# Altium schematic sheet LIDO-HW.003.BlockDiagram.SchDoc
size A3; CompanyName: EST-Floattech; DrawnBy: RR; Organization: EST-Floattech; Address2: Zandsteen 1; Address3: 2132 MZ; Address4: Hoofddorp; DocumentNumber: 21xxx; Revision: 1.0; SheetNumber: 3; SheetTotal: 17
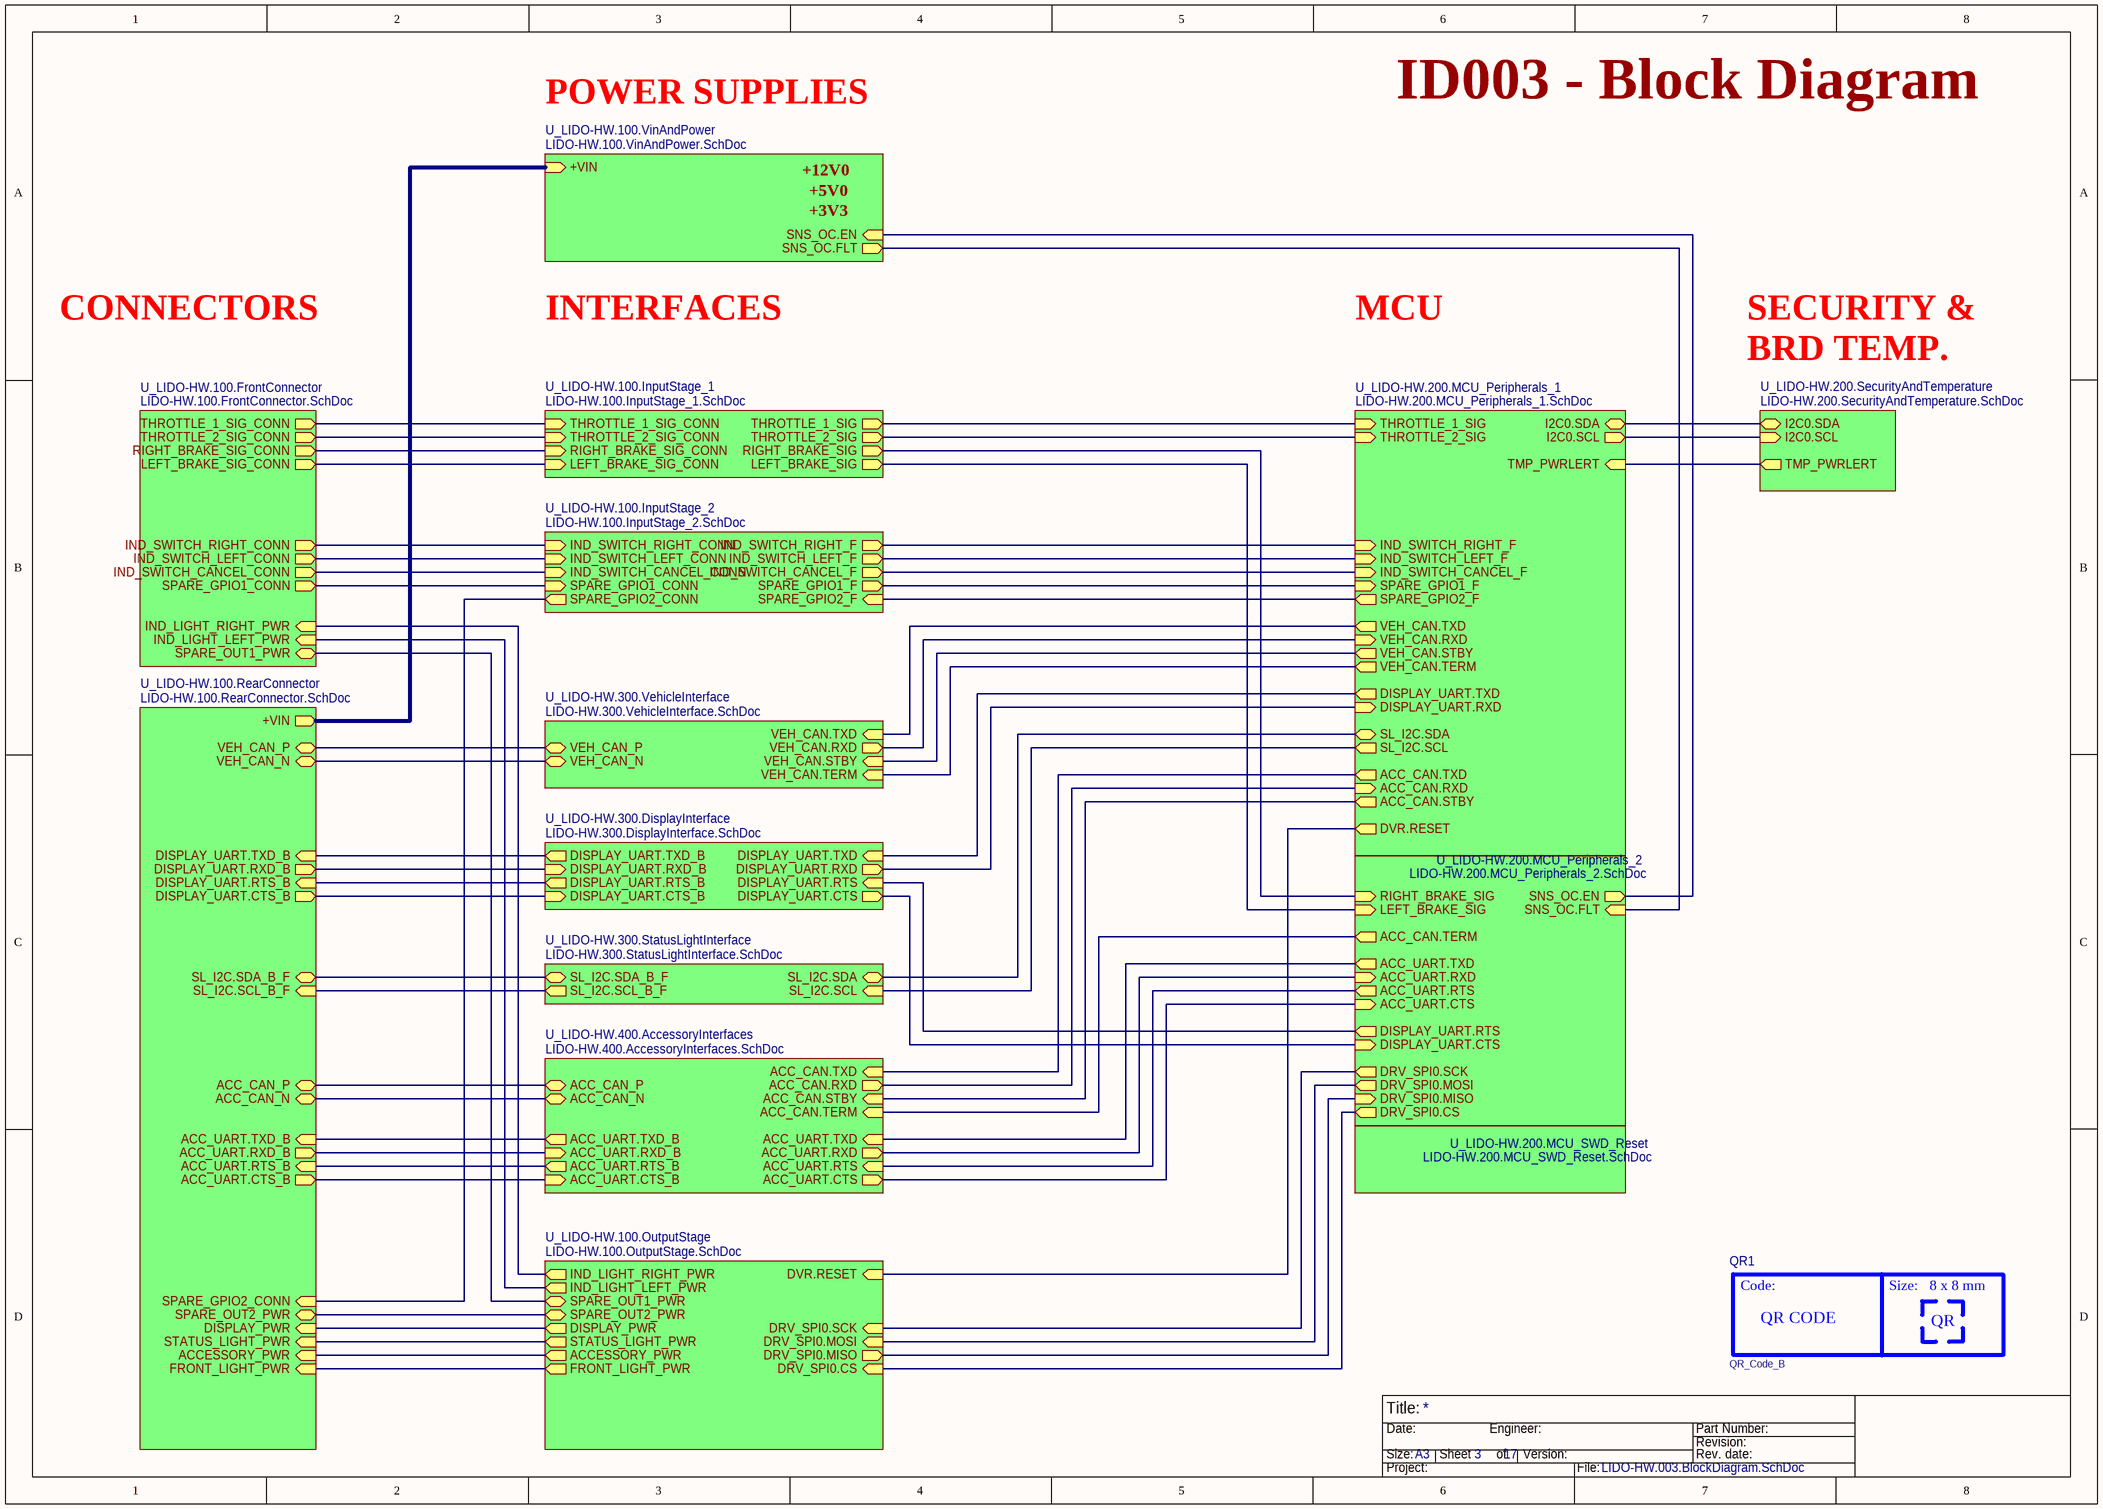
[diagram p0: LIDO-HW.003.BlockDiagram.SchDoc]

## Parts
QR1  QR_Code_B  [QR_CODE_8X8_A]  (no BOM)

## Sub-sheets
U_LIDO-HW.100.FrontConnector = LIDO-HW.100.FrontConnector.SchDoc: IND_LIGHT_LEFT_PWR (in), IND_LIGHT_RIGHT_PWR (in), THROTTLE_1_SIG_CONN (out), THROTTLE_2_SIG_CONN (out), RIGHT_BRAKE_SIG_CONN (out), LEFT_BRAKE_SIG_CONN (out), SPARE_OUT1_PWR (bidir), IND_SWITCH_CANCEL_CONN (out), SPARE_GPIO1_CONN (out), IND_SWITCH_LEFT_CONN (out), IND_SWITCH_RIGHT_CONN (out)
U_LIDO-HW.100.InputStage_1 = LIDO-HW.100.InputStage_1.SchDoc: THROTTLE_1_SIG (out), THROTTLE_1_SIG_CONN (in), THROTTLE_2_SIG (out), THROTTLE_2_SIG_CONN (in), RIGHT_BRAKE_SIG (out), RIGHT_BRAKE_SIG_CONN (in), LEFT_BRAKE_SIG (out), LEFT_BRAKE_SIG_CONN (in)
U_LIDO-HW.100.InputStage_2 = LIDO-HW.100.InputStage_2.SchDoc: IND_SWITCH_LEFT_F (out), IND_SWITCH_LEFT_CONN (in), IND_SWITCH_RIGHT_CONN (in), IND_SWITCH_RIGHT_F (out), SPARE_GPIO1_CONN (in), IND_SWITCH_CANCEL_CONN (in), IND_SWITCH_CANCEL_F (out), SPARE_GPIO2_CONN (out), SPARE_GPIO1_F (out), SPARE_GPIO2_F (in)
U_LIDO-HW.100.OutputStage = LIDO-HW.100.OutputStage.SchDoc: FRONT_LIGHT_PWR (out), IND_LIGHT_LEFT_PWR (out), IND_LIGHT_RIGHT_PWR (out), ACCESSORY_PWR (out), STATUS_LIGHT_PWR (out), SPARE_OUT2_PWR (bidir), SPARE_OUT1_PWR (bidir), DISPLAY_PWR (out), DRV_SPI0.MISO (out), DRV_SPI0.SCK (in), DRV_SPI0.MOSI (in), DRV_SPI0.CS (in), DVR.RESET (in)
U_LIDO-HW.100.RearConnector = LIDO-HW.100.RearConnector.SchDoc: ACC_CAN_P (bidir), ACC_CAN_N (bidir), ACC_UART.TXD_B (in), ACC_UART.RXD_B (out), ACC_UART.CTS_B (out), ACC_UART.RTS_B (in), SL_I2C.SDA_B_F (bidir), SL_I2C.SCL_B_F (in), FRONT_LIGHT_PWR (in), VEH_CAN_P (bidir), VEH_CAN_N (bidir), DISPLAY_UART.TXD_B (in), DISPLAY_UART.RXD_B (out), DISPLAY_PWR (in), STATUS_LIGHT_PWR (in), ACCESSORY_PWR (in), SPARE_OUT2_PWR (bidir), SPARE_GPIO2_CONN (in), DISPLAY_UART.RTS_B (in), DISPLAY_UART.CTS_B (out), +VIN (out)
U_LIDO-HW.100.VinAndPower = LIDO-HW.100.VinAndPower.SchDoc: SNS_OC.FLT (out), SNS_OC.EN (in), +VIN (in)
U_LIDO-HW.200.MCU_Peripherals_1 = LIDO-HW.200.MCU_Peripherals_1.SchDoc: I2C0.SDA (bidir), I2C0.SCL (out), TMP_PWRLERT (in), VEH_CAN.TXD (out), VEH_CAN.RXD (in), VEH_CAN.STBY (out), ACC_CAN.TXD (out), ACC_CAN.RXD (in), ACC_CAN.STBY (out), VEH_CAN.TERM (out), SL_I2C.SDA (bidir), SL_I2C.SCL (out), DISPLAY_UART.TXD (out), DISPLAY_UART.RXD (in), THROTTLE_1_SIG (in), THROTTLE_2_SIG (in), IND_SWITCH_LEFT_F (in), IND_SWITCH_RIGHT_F (in), IND_SWITCH_CANCEL_F (in), DVR.RESET (out), SPARE_GPIO1_F (in), SPARE_GPIO2_F (out)
U_LIDO-HW.200.MCU_Peripherals_2 = LIDO-HW.200.MCU_Peripherals_2.SchDoc: ACC_UART.TXD (out), ACC_UART.RXD (in), ACC_UART.CTS (in), ACC_UART.RTS (out), DRV_SPI0.CS (out), RIGHT_BRAKE_SIG (in), LEFT_BRAKE_SIG (in), DRV_SPI0.MISO (in), DRV_SPI0.SCK (out), DRV_SPI0.MOSI (out), DISPLAY_UART.CTS (in), DISPLAY_UART.RTS (out), SNS_OC.FLT (in), SNS_OC.EN (out), ACC_CAN.TERM (out)
U_LIDO-HW.200.MCU_SWD_Reset = LIDO-HW.200.MCU_SWD_Reset.SchDoc: no entries
U_LIDO-HW.200.SecurityAndTemperature = LIDO-HW.200.SecurityAndTemperature.SchDoc: I2C0.SDA (bidir), I2C0.SCL (in), TMP_PWRLERT (out)
U_LIDO-HW.300.DisplayInterface = LIDO-HW.300.DisplayInterface.SchDoc: DISPLAY_UART.TXD (in), DISPLAY_UART.RXD (out), DISPLAY_UART.CTS (out), DISPLAY_UART.RTS (in), DISPLAY_UART.TXD_B (out), DISPLAY_UART.RXD_B (in), DISPLAY_UART.CTS_B (in), DISPLAY_UART.RTS_B (out)
U_LIDO-HW.300.StatusLightInterface = LIDO-HW.300.StatusLightInterface.SchDoc: SL_I2C.SDA (bidir), SL_I2C.SCL (in), SL_I2C.SDA_B_F (bidir), SL_I2C.SCL_B_F (out)
U_LIDO-HW.300.VehicleInterface = LIDO-HW.300.VehicleInterface.SchDoc: VEH_CAN.TXD (in), VEH_CAN.RXD (out), VEH_CAN.STBY (in), VEH_CAN.TERM (in), VEH_CAN_P (bidir), VEH_CAN_N (bidir)
U_LIDO-HW.400.AccessoryInterfaces = LIDO-HW.400.AccessoryInterfaces.SchDoc: ACC_CAN.TXD (in), ACC_CAN.RXD (out), ACC_CAN.STBY (in), ACC_UART.TXD (in), ACC_UART.RXD (out), ACC_UART.CTS (out), ACC_UART.RTS (in), ACC_UART.TXD_B (out), ACC_UART.RXD_B (in), ACC_UART.CTS_B (in), ACC_UART.RTS_B (out), ACC_CAN_P (bidir), ACC_CAN_N (bidir), ACC_CAN.TERM (in)

## Nets
(unnamed): sheet U_LIDO-HW.100.FrontConnector/IND_LIGHT_LEFT_PWR, sheet U_LIDO-HW.100.OutputStage/IND_LIGHT_LEFT_PWR
(unnamed): sheet U_LIDO-HW.100.FrontConnector/IND_LIGHT_RIGHT_PWR, sheet U_LIDO-HW.100.OutputStage/IND_LIGHT_RIGHT_PWR
(unnamed): sheet U_LIDO-HW.100.FrontConnector/THROTTLE_1_SIG_CONN, sheet U_LIDO-HW.100.InputStage_1/THROTTLE_1_SIG_CONN
(unnamed): sheet U_LIDO-HW.100.FrontConnector/THROTTLE_2_SIG_CONN, sheet U_LIDO-HW.100.InputStage_1/THROTTLE_2_SIG_CONN
(unnamed): sheet U_LIDO-HW.100.FrontConnector/RIGHT_BRAKE_SIG_CONN, sheet U_LIDO-HW.100.InputStage_1/RIGHT_BRAKE_SIG_CONN
(unnamed): sheet U_LIDO-HW.100.FrontConnector/LEFT_BRAKE_SIG_CONN, sheet U_LIDO-HW.100.InputStage_1/LEFT_BRAKE_SIG_CONN
(unnamed): sheet U_LIDO-HW.100.FrontConnector/SPARE_OUT1_PWR, sheet U_LIDO-HW.100.OutputStage/SPARE_OUT1_PWR
(unnamed): sheet U_LIDO-HW.100.FrontConnector/IND_SWITCH_CANCEL_CONN, sheet U_LIDO-HW.100.InputStage_2/IND_SWITCH_CANCEL_CONN
(unnamed): sheet U_LIDO-HW.100.FrontConnector/SPARE_GPIO1_CONN, sheet U_LIDO-HW.100.InputStage_2/SPARE_GPIO1_CONN
(unnamed): sheet U_LIDO-HW.100.FrontConnector/IND_SWITCH_LEFT_CONN, sheet U_LIDO-HW.100.InputStage_2/IND_SWITCH_LEFT_CONN
(unnamed): sheet U_LIDO-HW.100.FrontConnector/IND_SWITCH_RIGHT_CONN, sheet U_LIDO-HW.100.InputStage_2/IND_SWITCH_RIGHT_CONN
(unnamed): sheet U_LIDO-HW.100.RearConnector/ACC_CAN_P, sheet U_LIDO-HW.400.AccessoryInterfaces/ACC_CAN_P
(unnamed): sheet U_LIDO-HW.100.RearConnector/ACC_CAN_N, sheet U_LIDO-HW.400.AccessoryInterfaces/ACC_CAN_N
(unnamed): sheet U_LIDO-HW.100.RearConnector/ACC_UART.TXD_B, sheet U_LIDO-HW.400.AccessoryInterfaces/ACC_UART.TXD_B
(unnamed): sheet U_LIDO-HW.100.RearConnector/ACC_UART.RXD_B, sheet U_LIDO-HW.400.AccessoryInterfaces/ACC_UART.RXD_B
(unnamed): sheet U_LIDO-HW.100.RearConnector/ACC_UART.CTS_B, sheet U_LIDO-HW.400.AccessoryInterfaces/ACC_UART.CTS_B
(unnamed): sheet U_LIDO-HW.100.RearConnector/ACC_UART.RTS_B, sheet U_LIDO-HW.400.AccessoryInterfaces/ACC_UART.RTS_B
(unnamed): sheet U_LIDO-HW.100.RearConnector/SL_I2C.SDA_B_F, sheet U_LIDO-HW.300.StatusLightInterface/SL_I2C.SDA_B_F
(unnamed): sheet U_LIDO-HW.100.RearConnector/SL_I2C.SCL_B_F, sheet U_LIDO-HW.300.StatusLightInterface/SL_I2C.SCL_B_F
(unnamed): sheet U_LIDO-HW.100.RearConnector/FRONT_LIGHT_PWR, sheet U_LIDO-HW.100.OutputStage/FRONT_LIGHT_PWR
(unnamed): sheet U_LIDO-HW.100.RearConnector/VEH_CAN_P, sheet U_LIDO-HW.300.VehicleInterface/VEH_CAN_P
(unnamed): sheet U_LIDO-HW.100.RearConnector/VEH_CAN_N, sheet U_LIDO-HW.300.VehicleInterface/VEH_CAN_N
(unnamed): sheet U_LIDO-HW.100.RearConnector/DISPLAY_UART.TXD_B, sheet U_LIDO-HW.300.DisplayInterface/DISPLAY_UART.TXD_B
(unnamed): sheet U_LIDO-HW.100.RearConnector/DISPLAY_UART.RXD_B, sheet U_LIDO-HW.300.DisplayInterface/DISPLAY_UART.RXD_B
(unnamed): sheet U_LIDO-HW.100.RearConnector/DISPLAY_PWR, sheet U_LIDO-HW.100.OutputStage/DISPLAY_PWR
(unnamed): sheet U_LIDO-HW.100.RearConnector/STATUS_LIGHT_PWR, sheet U_LIDO-HW.100.OutputStage/STATUS_LIGHT_PWR
(unnamed): sheet U_LIDO-HW.100.RearConnector/ACCESSORY_PWR, sheet U_LIDO-HW.100.OutputStage/ACCESSORY_PWR
(unnamed): sheet U_LIDO-HW.100.RearConnector/SPARE_OUT2_PWR, sheet U_LIDO-HW.100.OutputStage/SPARE_OUT2_PWR
(unnamed): sheet U_LIDO-HW.100.RearConnector/SPARE_GPIO2_CONN, sheet U_LIDO-HW.100.InputStage_2/SPARE_GPIO2_CONN
(unnamed): sheet U_LIDO-HW.100.RearConnector/DISPLAY_UART.RTS_B, sheet U_LIDO-HW.300.DisplayInterface/DISPLAY_UART.RTS_B
(unnamed): sheet U_LIDO-HW.100.RearConnector/DISPLAY_UART.CTS_B, sheet U_LIDO-HW.300.DisplayInterface/DISPLAY_UART.CTS_B
(unnamed): sheet U_LIDO-HW.100.RearConnector/+VIN, sheet U_LIDO-HW.100.VinAndPower/+VIN
(unnamed): sheet U_LIDO-HW.100.VinAndPower/SNS_OC.FLT, sheet U_LIDO-HW.200.MCU_Peripherals_2/SNS_OC.FLT
(unnamed): sheet U_LIDO-HW.100.VinAndPower/SNS_OC.EN, sheet U_LIDO-HW.200.MCU_Peripherals_2/SNS_OC.EN
(unnamed): sheet U_LIDO-HW.100.InputStage_1/THROTTLE_1_SIG, sheet U_LIDO-HW.200.MCU_Peripherals_1/THROTTLE_1_SIG
(unnamed): sheet U_LIDO-HW.100.InputStage_1/THROTTLE_2_SIG, sheet U_LIDO-HW.200.MCU_Peripherals_1/THROTTLE_2_SIG
(unnamed): sheet U_LIDO-HW.100.InputStage_1/RIGHT_BRAKE_SIG, sheet U_LIDO-HW.200.MCU_Peripherals_2/RIGHT_BRAKE_SIG
(unnamed): sheet U_LIDO-HW.100.InputStage_1/LEFT_BRAKE_SIG, sheet U_LIDO-HW.200.MCU_Peripherals_2/LEFT_BRAKE_SIG
(unnamed): sheet U_LIDO-HW.100.InputStage_2/IND_SWITCH_LEFT_F, sheet U_LIDO-HW.200.MCU_Peripherals_1/IND_SWITCH_LEFT_F
(unnamed): sheet U_LIDO-HW.100.InputStage_2/IND_SWITCH_RIGHT_F, sheet U_LIDO-HW.200.MCU_Peripherals_1/IND_SWITCH_RIGHT_F
(unnamed): sheet U_LIDO-HW.100.InputStage_2/IND_SWITCH_CANCEL_F, sheet U_LIDO-HW.200.MCU_Peripherals_1/IND_SWITCH_CANCEL_F
(unnamed): sheet U_LIDO-HW.100.InputStage_2/SPARE_GPIO1_F, sheet U_LIDO-HW.200.MCU_Peripherals_1/SPARE_GPIO1_F
(unnamed): sheet U_LIDO-HW.100.InputStage_2/SPARE_GPIO2_F, sheet U_LIDO-HW.200.MCU_Peripherals_1/SPARE_GPIO2_F
(unnamed): sheet U_LIDO-HW.100.OutputStage/DRV_SPI0.MISO, sheet U_LIDO-HW.200.MCU_Peripherals_2/DRV_SPI0.MISO
(unnamed): sheet U_LIDO-HW.100.OutputStage/DRV_SPI0.SCK, sheet U_LIDO-HW.200.MCU_Peripherals_2/DRV_SPI0.SCK
(unnamed): sheet U_LIDO-HW.100.OutputStage/DRV_SPI0.MOSI, sheet U_LIDO-HW.200.MCU_Peripherals_2/DRV_SPI0.MOSI
(unnamed): sheet U_LIDO-HW.100.OutputStage/DRV_SPI0.CS, sheet U_LIDO-HW.200.MCU_Peripherals_2/DRV_SPI0.CS
(unnamed): sheet U_LIDO-HW.100.OutputStage/DVR.RESET, sheet U_LIDO-HW.200.MCU_Peripherals_1/DVR.RESET
(unnamed): sheet U_LIDO-HW.200.MCU_Peripherals_1/I2C0.SDA, sheet U_LIDO-HW.200.SecurityAndTemperature/I2C0.SDA
(unnamed): sheet U_LIDO-HW.200.MCU_Peripherals_1/I2C0.SCL, sheet U_LIDO-HW.200.SecurityAndTemperature/I2C0.SCL
(unnamed): sheet U_LIDO-HW.200.MCU_Peripherals_1/TMP_PWRLERT, sheet U_LIDO-HW.200.SecurityAndTemperature/TMP_PWRLERT
(unnamed): sheet U_LIDO-HW.200.MCU_Peripherals_1/VEH_CAN.TXD, sheet U_LIDO-HW.300.VehicleInterface/VEH_CAN.TXD
(unnamed): sheet U_LIDO-HW.200.MCU_Peripherals_1/VEH_CAN.RXD, sheet U_LIDO-HW.300.VehicleInterface/VEH_CAN.RXD
(unnamed): sheet U_LIDO-HW.200.MCU_Peripherals_1/VEH_CAN.STBY, sheet U_LIDO-HW.300.VehicleInterface/VEH_CAN.STBY
(unnamed): sheet U_LIDO-HW.200.MCU_Peripherals_1/ACC_CAN.TXD, sheet U_LIDO-HW.400.AccessoryInterfaces/ACC_CAN.TXD
(unnamed): sheet U_LIDO-HW.200.MCU_Peripherals_1/ACC_CAN.RXD, sheet U_LIDO-HW.400.AccessoryInterfaces/ACC_CAN.RXD
(unnamed): sheet U_LIDO-HW.200.MCU_Peripherals_1/ACC_CAN.STBY, sheet U_LIDO-HW.400.AccessoryInterfaces/ACC_CAN.STBY
(unnamed): sheet U_LIDO-HW.200.MCU_Peripherals_1/VEH_CAN.TERM, sheet U_LIDO-HW.300.VehicleInterface/VEH_CAN.TERM
(unnamed): sheet U_LIDO-HW.200.MCU_Peripherals_1/SL_I2C.SDA, sheet U_LIDO-HW.300.StatusLightInterface/SL_I2C.SDA
(unnamed): sheet U_LIDO-HW.200.MCU_Peripherals_1/SL_I2C.SCL, sheet U_LIDO-HW.300.StatusLightInterface/SL_I2C.SCL
(unnamed): sheet U_LIDO-HW.200.MCU_Peripherals_1/DISPLAY_UART.TXD, sheet U_LIDO-HW.300.DisplayInterface/DISPLAY_UART.TXD
(unnamed): sheet U_LIDO-HW.200.MCU_Peripherals_1/DISPLAY_UART.RXD, sheet U_LIDO-HW.300.DisplayInterface/DISPLAY_UART.RXD
(unnamed): sheet U_LIDO-HW.200.MCU_Peripherals_2/ACC_UART.TXD, sheet U_LIDO-HW.400.AccessoryInterfaces/ACC_UART.TXD
(unnamed): sheet U_LIDO-HW.200.MCU_Peripherals_2/ACC_UART.RXD, sheet U_LIDO-HW.400.AccessoryInterfaces/ACC_UART.RXD
(unnamed): sheet U_LIDO-HW.200.MCU_Peripherals_2/ACC_UART.CTS, sheet U_LIDO-HW.400.AccessoryInterfaces/ACC_UART.CTS
(unnamed): sheet U_LIDO-HW.200.MCU_Peripherals_2/ACC_UART.RTS, sheet U_LIDO-HW.400.AccessoryInterfaces/ACC_UART.RTS
(unnamed): sheet U_LIDO-HW.200.MCU_Peripherals_2/DISPLAY_UART.CTS, sheet U_LIDO-HW.300.DisplayInterface/DISPLAY_UART.CTS
(unnamed): sheet U_LIDO-HW.200.MCU_Peripherals_2/DISPLAY_UART.RTS, sheet U_LIDO-HW.300.DisplayInterface/DISPLAY_UART.RTS
(unnamed): sheet U_LIDO-HW.200.MCU_Peripherals_2/ACC_CAN.TERM, sheet U_LIDO-HW.400.AccessoryInterfaces/ACC_CAN.TERM

## Notes on the sheet
- POWER SUPPLIES
- ID003 - Block Diagram
- +12V0
- +5V0
- +3V3
- CONNECTORS
- INTERFACES
- MCU
- SECURITY &
- BRD TEMP.
- Title:
- Size:
- Date:
- A3
- Sheet       of
- Engineer:
- Version:
- Part Number:
- Revision:
- Rev. date:
- Project:
- File:
- (in symbol 25) Code:; Size:; 8 x 8 mm; QR CODE; QR

## Library data of the parts
QR1 = 25: QR Code 8x8mm; Part Value: Legend; Obsolete Part: False; Component ID: 25; Label: QR_Code_B; Part Type: no BOM